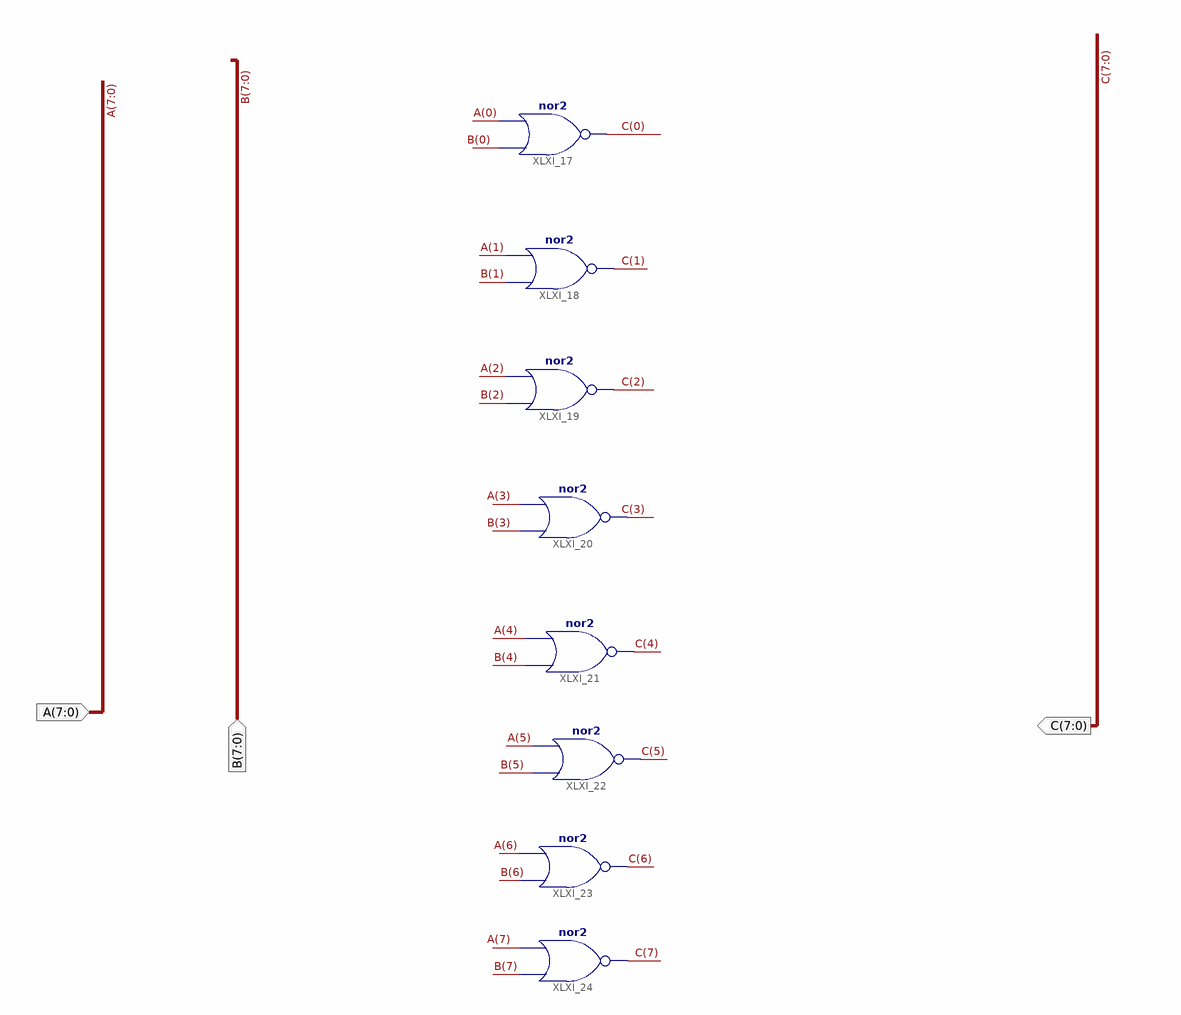
[diagram p0: schematic sheet 1]
// Xilinx ISE schematic nor2_8bits.sch (artix7) as structural Verilog: 8 symbols, 3 ports
module nor2_8bits (
  input  [7:0] A,
  input  [7:0] B,
  output [7:0] C
);

  nor XLXI_17 (C[0], B[0], A[0]);
  nor XLXI_18 (C[1], B[1], A[1]);
  nor XLXI_19 (C[2], B[2], A[2]);
  nor XLXI_20 (C[3], B[3], A[3]);
  nor XLXI_21 (C[4], B[4], A[4]);
  nor XLXI_22 (C[5], B[5], A[5]);
  nor XLXI_23 (C[6], B[6], A[6]);
  nor XLXI_24 (C[7], B[7], A[7]);
endmodule
